# Altium project main.PrjPCB
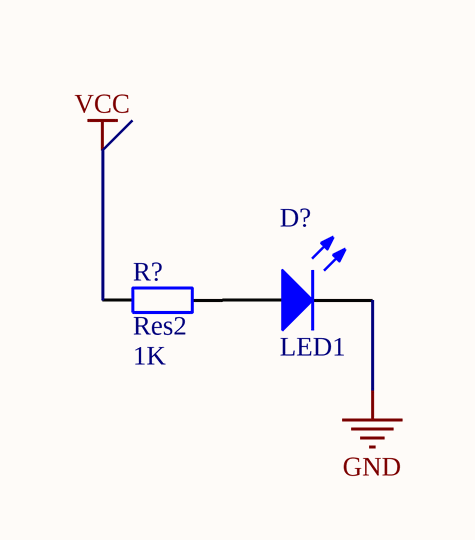
[diagram p0: scm-1.SchDoc]
2 sheets, 5 parts. Net scope: global (net labels, ports and power ports of the same name join across sheets).
Board file: pcb-1.PcbDoc
Sheets:
  scm-1.SchDoc
  scm-2.SchDoc

## Sheet scm-1.SchDoc: Test-scm1
size A4; Date: 2019-05-04; Author: Benjamin142857; DrawnBy: Benjamin142857; Engineer: Benjamin142857; ImagePath: C:\Program Files\Altium Designer Summer 09\Examples\20180504-Test1

### Parts
D?  LED1  [LED-1]
R?  Res2  value 1K  [AXIAL-0.4]

### Nets
GND: D?.2(K)
VCC: R?.1
NetD?_1: D?.1(A) R?.2

### Library data of the parts
D? = LED1: Typical RED GaAs LED; Published: 8-Jun-2000; LatestRevisionDate: 08-Jul-2005; LatestRevisionNote: Mech Layer 1 removed.; PackageReference: LED-1; Publisher: Altium Limited
R? = Res2: Resistor; Published: 8-Jun-2000; LatestRevisionDate: 17-Jul-2002; LatestRevisionNote: Re-released for DXP Platform.; PackageReference: AXIAL-0.4; Publisher: Altium Limited

## Sheet scm-2.SchDoc
size A4
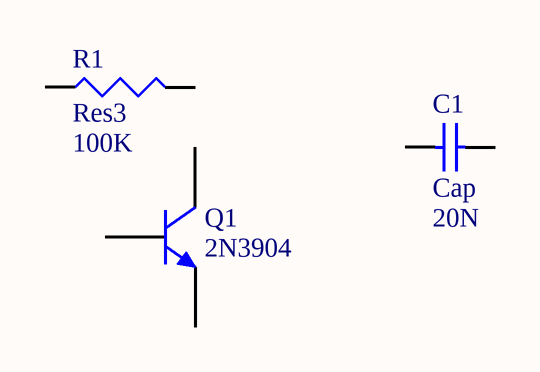
[diagram p1: scm-2.SchDoc]

### Parts
C1  Cap  value 20N  [RAD-0.3]
Q1  2N3904  [BCY-W3/E4]
R1  Res3  value 100K  [RESC1608L]

### Nets

Not connected (* = marked no-connect by the designer): C1 1 2; Q1 1(E) 2(B) 3(C); R1 1 2

### Library data of the parts
C1 = Cap: Capacitor; Published: 8-Jun-2000; LatestRevisionDate: 17-Jul-2002; LatestRevisionNote: Re-released for DXP Platform.; PackageReference: RAD-0.3; Publisher: Altium Limited
Q1 = 2N3904: NPN General Purpose Amplifier; Published: 8-Jun-2000; LatestRevisionDate: 15-Jan-2003; LatestRevisionNote: PCB Footprint 'BCY-W3/D4.7' replaced; DatasheetVersion: 1997; PackageVersion: Sep-1998; PackageReference: TO-92A; Publisher: Altium Limited; Code_JEDEC: TO-92A; ComponentLink1Description: Manufacturer Link; ComponentLink1URL: http://www.fairchildsemi.com/; ComponentLink2Description: Datasheet; ComponentLink2URL: http://www.fairchildsemi.com/ds/2N%2F2N3904.pdf
R1 = Res3: Resistor; Published: 8-Jun-2000; LatestRevisionDate: 29-May-2009; LatestRevisionNote: IPC-7351 Footprint Added.; PackageReference: J1-0603; Publisher: Altium Limited; PackageDescription: Chip Resistor